# Altium schematic sheet peripherals.SchDoc: Peripherals
size A; SheetNumber: 4; SheetTotal: 4
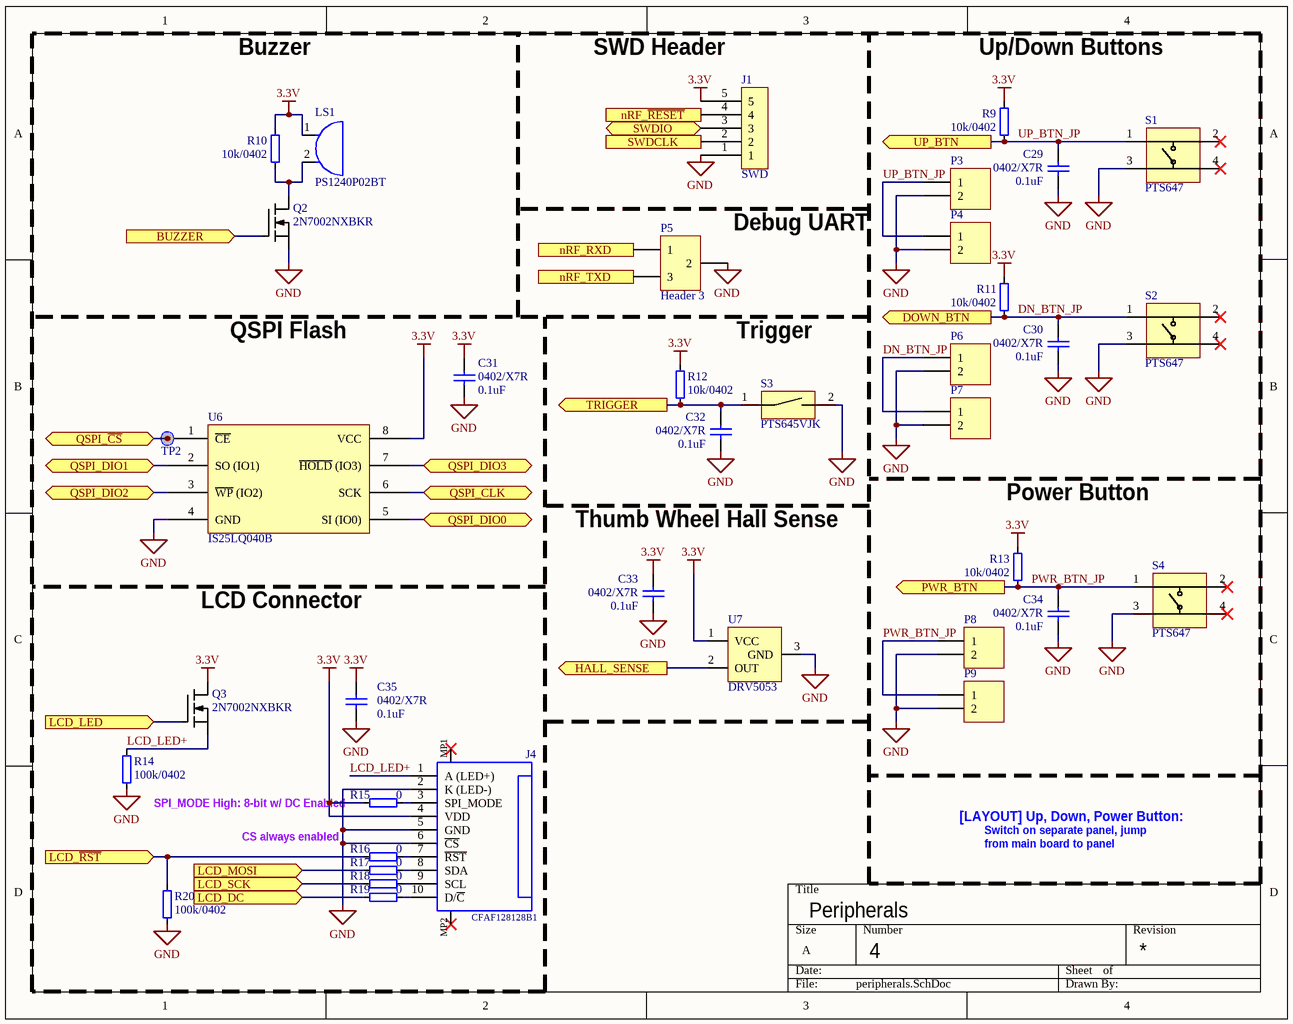
[diagram p0: peripherals.SchDoc]

## Parts
C29  0402/X7R  value 0.1uF  [CAPC1005X04L]
C30  0402/X7R  value 0.1uF  [CAPC1005X04L]
C31  0402/X7R  value 0.1uF  [CAPC1005X04L]
C32  0402/X7R  value 0.1uF  [CAPC1005X04L]
C33  0402/X7R  value 0.1uF  [CAPC1005X04L]
C34  0402/X7R  value 0.1uF  [CAPC1005X04L]
C35  0402/X7R  value 0.1uF  [CAPC1005X04L]
J1  SWD  [SWD 5-pin]
J4  CFAF128128B1  [68711014022]
LS1  PS1240P02BT  [Passive Buzzer]
P3  UP  [HDR1X2]  (value not drawn)
P4  UP  [HDR1X2]  (value not drawn)
P5  Header 3  [UART]
P6  DOWN  [HDR1X2]  (value not drawn)
P7  DOWN  [HDR1X2]  (value not drawn)
P8  POWER  [HDR1X2]  (value not drawn)
P9  POWER  [HDR1X2]  (value not drawn)
Q2  2N7002NXBKR  [SOT190P230X110-3N]
Q3  2N7002NXBKR  [SOT190P230X110-3N]
R9  10k/0402  [0402]
R10  10k/0402  [0402]
R11  10k/0402  [0402]
R12  10k/0402  [0402]
R13  10k/0402  [0402]
R14  100k/0402  [0402]
R15  value 0  [J1-0603]  (hidden comment: Resistor)
R16  value 0  [J1-0603]  (hidden comment: Resistor)
R17  value 0  [J1-0603]  (hidden comment: Resistor)
R18  value 0  [J1-0603]  (hidden comment: Resistor)
R19  value 0  [J1-0603]  (hidden comment: Resistor)
R20  100k/0402  [0402]
S1  PTS647  [SW_CK_ PTS647SK50SMTR2LFS]
S2  PTS647  [SW_CK_ PTS647SK50SMTR2LFS]
S3  PTS645VJK  [SW_CK_PTS645VJK612LFS]
S4  PTS647  [SW_CK_ PTS647SK50SMTR2LFS]
TP2  TP_Via  [TP_Via]  (value not drawn)
U6  IS25LQ040B  [SOIC127P600X175-8N]
U7  DRV5053  [SOT190P237X112-3N]

## Ports
BUZZER (in), DOWN_BTN (out), HALL_SENSE (out), LCD_DC (in), LCD_LED (in), LCD_MOSI (in), LCD_SCK (in), LCD_~{RST} (in), nRF_RXD (out), nRF_TXD (in), nRF_~{RESET} (out), PWR_BTN (out), QSPI_CLK (bidir), QSPI_DIO0 (bidir), QSPI_DIO1 (bidir), QSPI_DIO2 (bidir), QSPI_DIO3 (bidir), QSPI_~{CS} (bidir), SWDCLK (out), SWDIO (bidir), TRIGGER (out), UP_BTN (out)

## Nets
3.3V: C31.2 C33.2 C35.2 J1.5 J4.4(VDD) LS1.1 Q3.3(D) R9.2 R10.2 R11.2 R12.2 R13.2 R15.2 U6.8(VCC) U7.1(VCC)
GND: C29.1 C30.1 C31.1 C32.1 C33.1 C34.1 C35.1 J1.1 J4.2(K_(LED-)) J4.5(GND) J4.6(~{CS}) P3.2 P4.2 P5.2 P6.2 P7.2 P8.2 P9.2 Q2.2(S) R14.1 R20.1 S1.3 S2.3 S3.2 S4.3 U6.4(GND) U7.3(GND)
BUZZER: Q2.1(G) ; port BUZZER
DN_BTN_JP: C30.2 P6.1 P7.1 R11.1 S2.1 ; port DOWN_BTN
HALL_SENSE: U7.2(OUT) ; port HALL_SENSE
LCD_DC: R19.2 ; port LCD_DC
LCD_LED: Q3.1(G) ; port LCD_LED
LCD_LED+: J4.1(A_(LED+)) Q3.2(S) R14.2
LCD_MOSI: R17.2 ; port LCD_MOSI
LCD_~{RST}: R16.2 R20.2 ; port LCD_~{RST}
LCD_SCK: R18.2 ; port LCD_SCK
nRF_~{RESET}: J1.4 ; port nRF_~{RESET}
nRF_RXD: P5.1 ; port nRF_RXD
nRF_TXD: P5.3 ; port nRF_TXD
PWR_BTN_JP: C34.2 P8.1 P9.1 R13.1 S4.1 ; port PWR_BTN
QSPI_~{CS}: TP2.1 U6.1(~{CE}) ; port QSPI_~{CS}
QSPI_CLK: U6.6(SCK) ; port QSPI_CLK
QSPI_DIO0: U6.5(SI_(IO0)) ; port QSPI_DIO0
QSPI_DIO1: U6.2(SO_(IO1)) ; port QSPI_DIO1
QSPI_DIO2: U6.3(~{WP}_(IO2)) ; port QSPI_DIO2
QSPI_DIO3: U6.7(~{HOLD}_(IO3)) ; port QSPI_DIO3
SWDCLK: J1.2 ; port SWDCLK
SWDIO: J1.3 ; port SWDIO
TRIGGER: C32.2 R12.1 S3.1 ; port TRIGGER
UP_BTN_JP: C29.2 P3.1 P4.1 R9.1 S1.1 ; port UP_BTN
NetJ4_3: J4.3(SPI_MODE) R15.1
NetJ4_7: J4.7(~{RST}) R16.1
NetJ4_8: J4.8(SDA) R17.1
NetJ4_9: J4.9(SCL) R18.1
NetJ4_10: J4.10(D/~{C}) R19.1
NetLS1_2: LS1.2 Q2.3(D) R10.1

Not connected (* = marked no-connect by the designer): J4 MP1* MP2*; S1 2* 4*; S2 2* 4*; S4 2* 4*

## Notes on the sheet
- Buzzer
- (near J1) SWD Header
- (near R9) Up/Down Buttons
- Debug UART
- QSPI Flash
- Trigger
- (near R13) Power Button
- Thumb Wheel Hall Sense
- LCD Connector
- (near R15) SPI_MODE High: 8-bit w/ DC Enabled
- CS always enabled
- Switch on separate panel, jump
- from main board to panel
- [LAYOUT] Up, Down, Power Button:

## Library data of the parts
C29-C35 = Cap: Capacitor; Published: 8-Jun-2000; LatestRevisionDate: 17-Jul-2002; LatestRevisionNote: Re-released for DXP Platform.; PackageReference: RAD-0.3; Publisher: Altium Limited; PackageDescription: Radial Cap, Thru-Hole; 2 Leads; 0.3 in Pin Spacing; ComponentLink1Description: Digikey; ComponentLink1URL: https://www.digikey.com/product-detail/en/w-rth-elektronik/885012205037/732-7532-1-ND/5454159
J1 = Debug_Header
J4 = CFAF128128B1-0145T: 10-pin 0.5mm pitch FPC for CFAF128128B1 TFT LCD; Manufacturer: Wurth Elektronik; Withstanding Voltage: 250VAC; Working Voltage: 50VAC; Rated Current: 0.5A; Contact Resistance: 20mOhm; Pin Number: 10; Contact Design: TopContact; Operating Temperature: -25to85degC; Manufacturer URL: http://www.we-online.de; Part Number: 68711014022; Pitch: 0.5mm; Publisher: WurthElektronik; Mounting Technology: SMT; Datasheet URL: https://katalog.we-online.de/em/datasheet/68711014022.pdf; Orientation: Horizontal; Package Reference: 68711014022; Packaging: TapeandReel; ComponentLink1Description: FPC Digikey; ComponentLink1URL: https://www.digikey.com/product-detail/en/5034801000/WM1389CT-ND/2356643; ComponentLink2Description: LCD MFG; ComponentLink2URL: https://www.crystalfontz.com/product/cfaf128128b10145t-128x128-graphic-tft-spi
LS1 = PS1240P02BT: Buzzers Transducer, Externally Driven Piezo 3V  4kHz 60dB @ 3V, 10cm Through Hole PC Pins; ComponentLink1Description: Digikey; ComponentLink1URL: https://www.digikey.com/product-detail/en/tdk-corporation/PS1240P02BT/445-2525-1-ND/935930; ComponentLink2Description: Datasheet; ComponentLink2URL: https://product.tdk.com/info/en/catalog/datasheets/piezoelectronic_buzzer_ps_en.pdf
P3 P4 P6-P9 = Header 2: Header, 2-Pin; LatestRevisionDate: 17-Jul-2002; LatestRevisionNote: Re-released for DXP Platform.; Publisher: Altium Limited
P5 = Header 3: Header, 3-Pin; LatestRevisionDate: 17-Jul-2002; LatestRevisionNote: Re-released for DXP Platform.; Publisher: Altium Limited
Q2 Q3 = 2N7002NXBKR: N-Channel 60V 270mA (Ta), 330mA (Tc) 310mW (Ta), 1.67W (Tc) Surface Mount TO-236AB; ComponentLink1Description: Digikey; ComponentLink1URL: https://www.digikey.com/product-detail/en/nexperia-usa-inc/2N7002NXBKR/1727-8642-1-ND/10416559; ComponentLink2Description: Datasheet; ComponentLink2URL: https://assets.nexperia.com/documents/data-sheet/2N7002NXBK.pdf
R9-R14 R20 = Resistor: Published: 8-Jun-2000; LatestRevisionDate: 17-Jul-2002; LatestRevisionNote: Re-released for DXP Platform.; PackageReference: AXIAL-0.4; Publisher: Altium Limited; PackageDescription: Axial Device, Thru-Hole; 2 Leads; 0.4 in Pin Spacing; ComponentLink1Description: Digikey
  R9-R13: ComponentLink1URL: https://www.digikey.com/product-detail/en/yageo/RC0402JR-0710KL/311-10KJRCT-ND/729365
  R14 R20: ComponentLink1URL: https://www.digikey.com/product-detail/en/yageo/RC0402FR-07100KL/311-100KLRCT-ND/729473
R15-R19 = Resistor: 0 Ohms Jumper Chip Resistor 0603 (1608 Metric) Automotive AEC-Q200, Moisture Resistant Metal Element; Published: 8-Jun-2000; LatestRevisionDate: 17-Jul-2002; LatestRevisionNote: Re-released for DXP Platform.; PackageReference: AXIAL-0.4; Publisher: Altium Limited; PackageDescription: Axial Device, Thru-Hole; 2 Leads; 0.4 in Pin Spacing; ComponentLink1Description: Digikey; ComponentLink1URL: https://www.digikey.com/product-detail/en/koa-speer-electronics-inc/RK73Z1JTTD/2019-RK73Z1JTTDCT-ND/9847522
S1 S2 S4 = SW_CK_ PTS647SK50SMTR2LFS: Tactile Switch SPST-NO Top Actuated Surface Mount; ComponentLink1Description: Digikey; ComponentLink1URL: https://www.digikey.com/product-detail/en/c-k/PTS-647-SK50-SMTR2-LFS/PTS647SK50SMTR2LFSCT-ND/9649868; ComponentLink2Description: Datasheet; ComponentLink2URL: https://dznh3ojzb2azq.cloudfront.net/products/Tactile/PTS647/documents/datasheet.pdf
S3 = SW_CK_PTS645VJK612LFS: Tactile Switch SPST-NO Side Actuated Through Hole, Right Angle; ComponentLink1Description: Digikey; ComponentLink1URL: https://www.digikey.com/product-detail/en/c-k/PTS645VJK612LFS/CKN10826-ND/7056048; ComponentLink2Description: Datasheet; ComponentLink2URL: https://dznh3ojzb2azq.cloudfront.net/products/Tactile/PTS645/documents/datasheet.pdf
TP2 = TP_Via: Test point as a via
U6 = IS25LQ040B-JNLE: FLASH - NOR Memory IC 4Mb (512K x 8) SPI - Quad I/O 104MHz  8-SOIC; ComponentLink1Description: Digikey; ComponentLink1URL: https://www.digikey.com/product-detail/en/issi-integrated-silicon-solution-inc/IS25LQ040B-JNLE/706-1316-ND/5189751; ComponentLink2Description: Datasheet; ComponentLink2URL: http://www.issi.com/WW/pdf/25LQ025B-512B-010B-020B-040B.pdf
U7 = DRV5053VAQDBZR: Hall Effect Sensor Single Axis SOT-23-3; ComponentLink1Description: Digikey; ComponentLink1URL: https://www.digikey.com/product-detail/en/texas-instruments/DRV5053VAQDBZR/296-38460-1-ND/5022225; ComponentLink2Description: Datasheet; ComponentLink2URL: http://www.ti.com/lit/ds/symlink/drv5053.pdf